# EasyEDA Pro project ProPrj_FLAVRTOWN BADGE_2026-02-28.epro, board PCB1
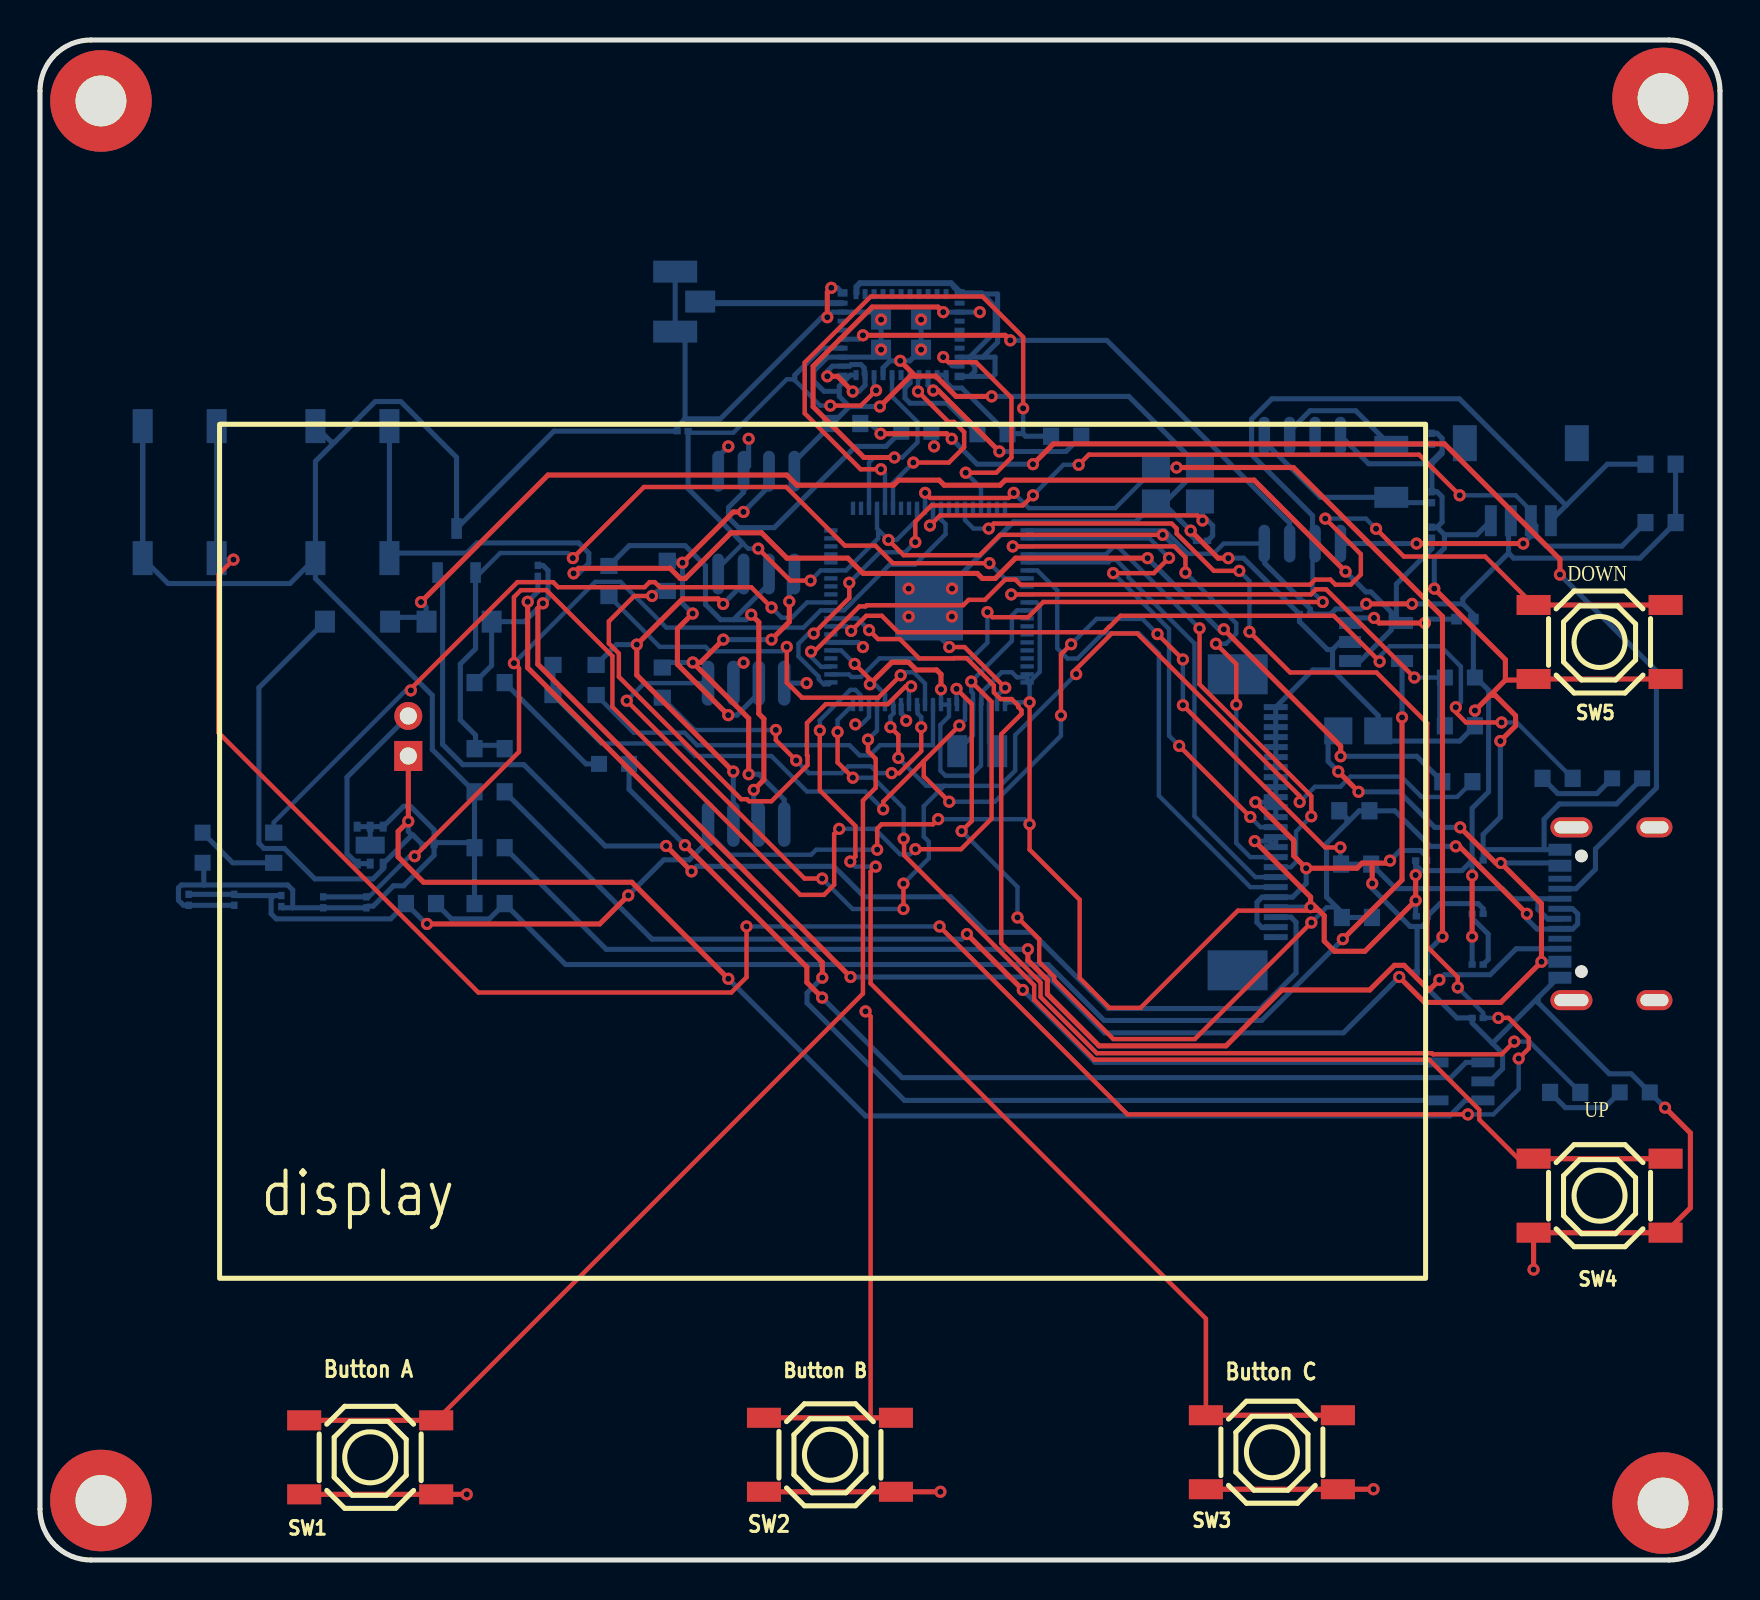
[diagram p1: board, top side]
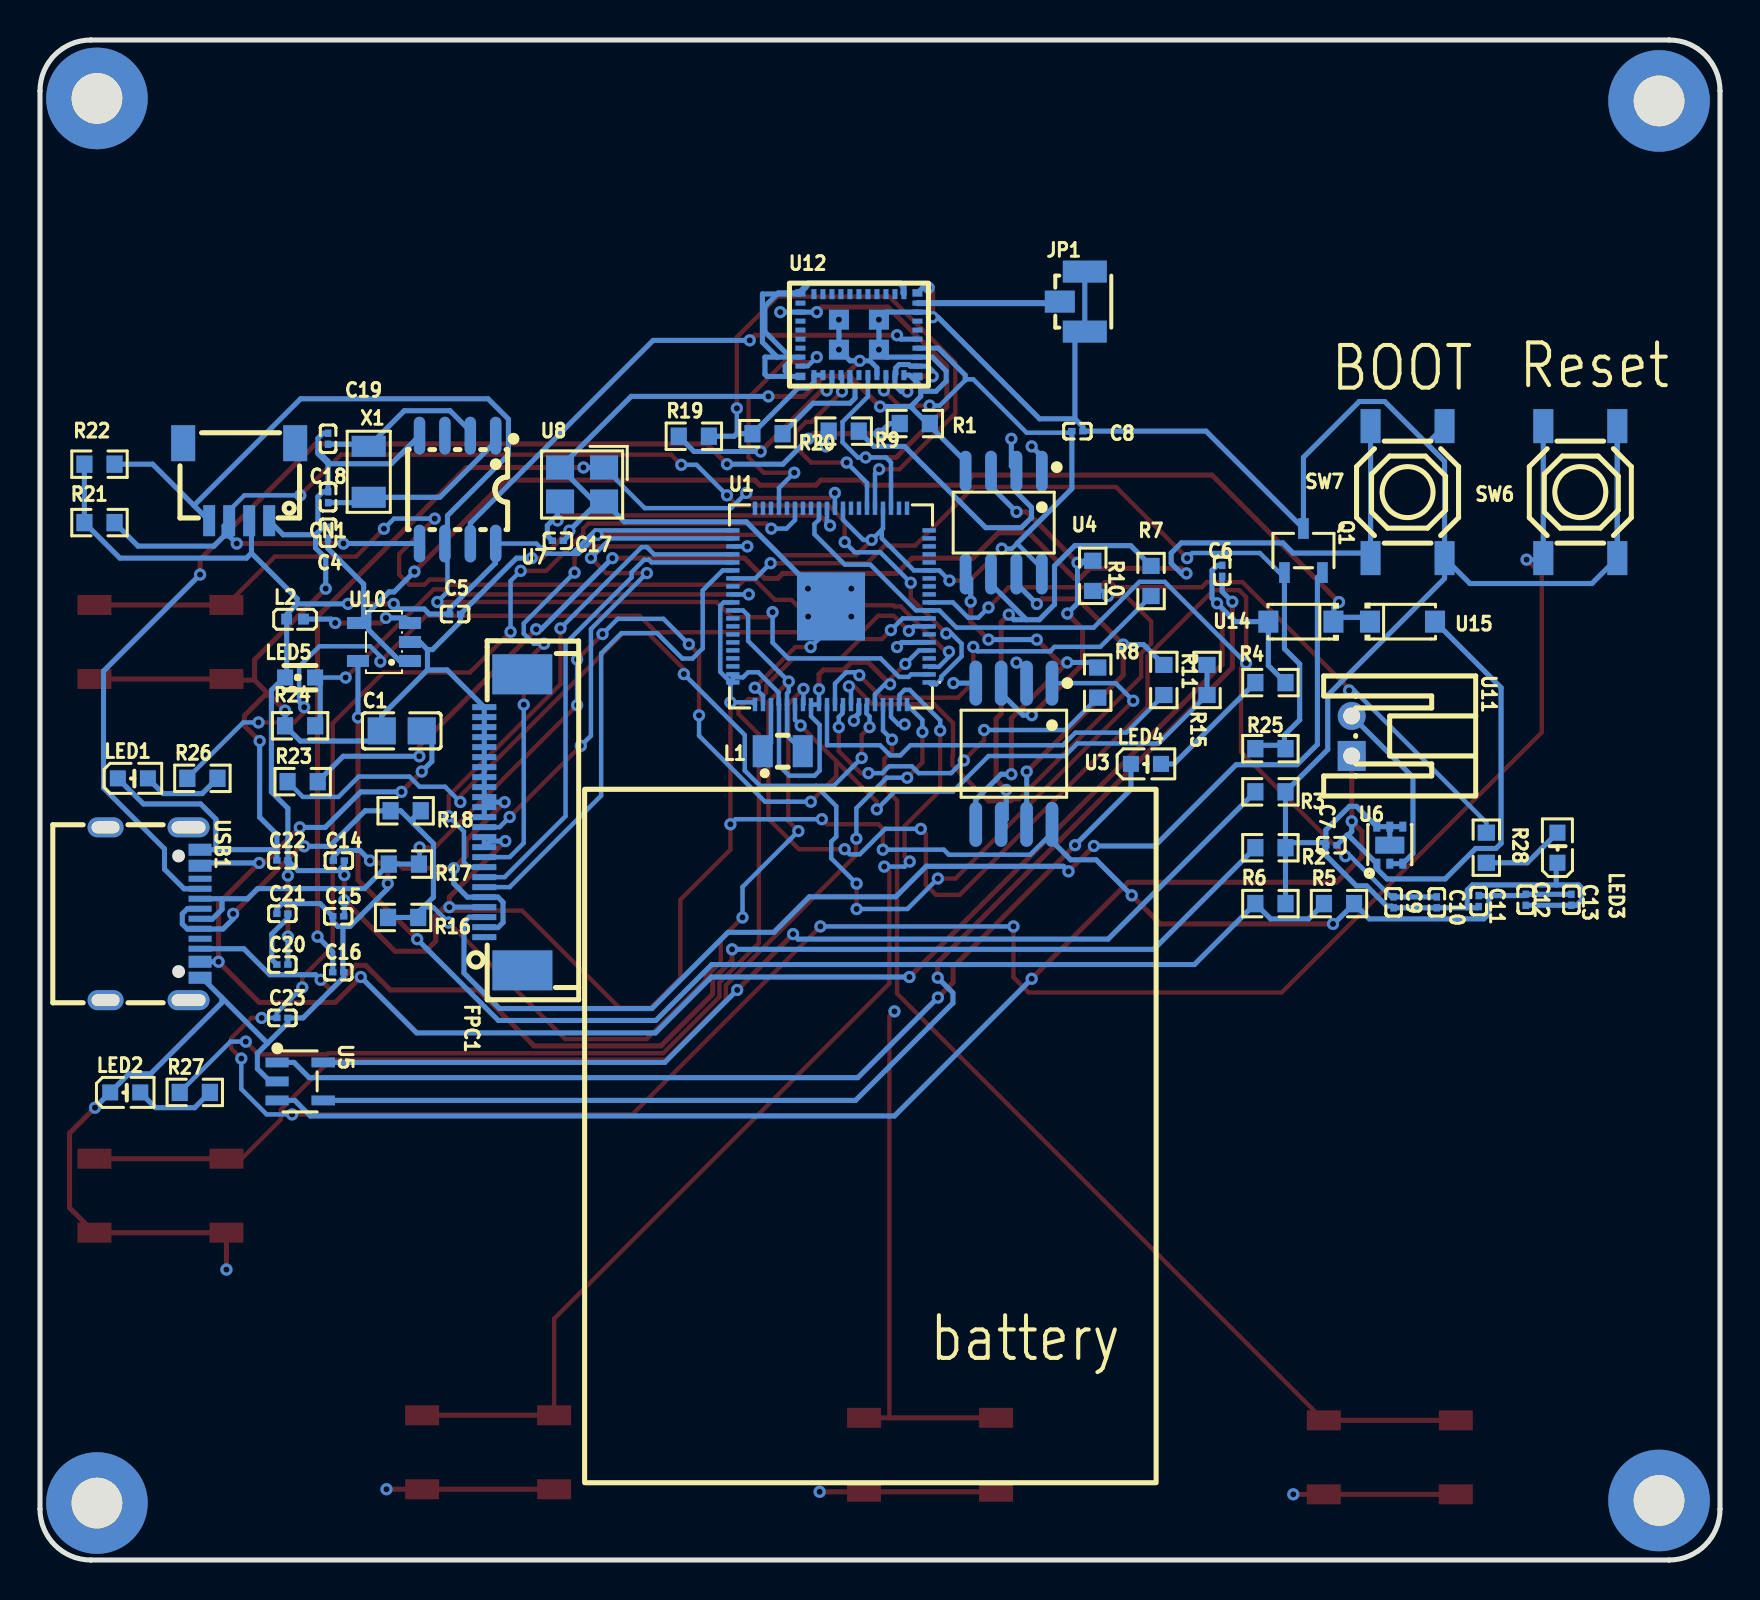
[diagram p2: board, bottom side, seen from below]

Outline 84 x 76 mm; copper layers: Top Layer, only ground, Power routing, Bottom Layer. Coordinates in mm from the lower left corner of the outline.
Outline path: 0,73.46 0,2.54 arc(0.74,0.74) 2.54,0 81.46,0 arc(83.26,0.74) 84,2.54 84,73.46 arc(83.26,75.26) 81.46,76 2.54,76 arc(0.74,75.26) 0,73.46
Stack: Top Layer 0.035mm Outer layer thickness 1oz / Dielectric1 0.2104mm 7628 RC49% 8.6mil / only ground 0.0152mm Inner layer thickness / Dielectric2 1.065mm 1.1mm H/HOZ Copper / Power routing 0.0152mm Inner layer thickness / Dielectric3 0.2104mm 7628 RC49% 8.6mil / Bottom Layer 0.035mm Outer layer thickness 1oz

## Design rules (mm)
template: JLCPCB Capability(Two Layers Board)
spacing copperThickness1oz (default): track to track 0.102, other pairs 0.152 to 0.3
spacing copperThickness2oz: track to track 0.203, other pairs 0.152 to 0.3
track width copperThickness1oz (default): min 0.127, default 0.254, max 2.54
track width copperThickness2oz: min 0.203, default 0.254, max 2.54
differential pair differentialPair (default): width min 0.127, default 0.254, max 2.54; gap min 0.152, default 0.152
via viaSize (default): diameter min 0.5, default 0.61, max 10; hole min 0.3, default 0.305, max 6.3
net VBUS_5V uses copperThickness2oz
net VSYS uses copperThickness2oz
net 3V3 uses copperThickness2oz
net VBAT uses copperThickness2oz

## Placement (name value [footprint] x y rotation side)
Button B  TS-1187A-C-E-B  [SW-SMD_4P-L5.1-W5.1-P3.70-LS6.5-TL_H2.5]  39.5 5.26 0 top
C1  100nF  [C0805]  65.91 41.46 180 bottom
C4  10μF  [C0201]  69.6 51.36 90 bottom
C5  22μF  [C0201]  63.25 47.3 0 bottom
C6  4.7μF  [C0201]  24.89 49.46 90 bottom
C7  100nF  [C0201]  19.43 35.74 0 bottom
C8  100nF  [C0201]  32.13 56.44 0 bottom
C9  4.7μF  [C0201]  16.32 32.88 270 bottom
C10  100nF  [C0201]  14.16 32.88 270 bottom
C11  100nF  [C0201]  12.06 32.95 90 bottom
C12  100nF  [C0201]  9.72 33.01 90 bottom
C13  100nF  [C0201]  7.43 33.01 270 bottom
C14  100nF  [C0201]  69.06 34.97 180 bottom
C15  100nF  [C0201]  69.09 32.19 180 bottom
C16  15pF  [C0201]  69.09 29.39 180 bottom
C17  15pF  [C0201]  58.1 50.96 0 bottom
C18  9pF  [C0201]  69.6 53.14 90 bottom
C19  9pF  [C0201]  69.6 56.06 90 bottom
C20  4.7μF  [C0201]  71.88 29.77 180 bottom
C21  100nF  [C0201]  71.88 32.31 180 bottom
C22  100nF  [C0201]  71.88 34.98 180 bottom
C23  100nF  [C0201]  71.88 27.11 180 bottom
CN1  SM04B-SRSS-TB(LF)(SN)  [CONN-SMD_4P-P1.00_SM04B-SRSS-TB-LF-SN]  74.04 53.9 0 bottom
FPC1  AFC07-S24FCA-00  [FPC-SMD_AFC07-S24FCA-00]  60.83 36.88 90 bottom
JP1  6GHz  [ANT-SMD_UFL-R-SMT-1-10]  32.38 62.92 180 bottom
L1  3.3uH  [IND-SMD_L2.0-W1.6_AOTA-B201610S3R3-101-T]  46.86 40.44 0 bottom
L2  2.2μH  [L0402]  71.25 47.04 180 bottom
LED1  19-213/T1D-KS1T1N/3T  [LED0603-R-RD]  79.36 39.08 180 bottom
LED2  19-213/T1D-KS1T1N/3T  [LED0603-R-RD]  79.74 23.38 180 bottom
LED3  19-213/T1D-KS1T1N/3T  [LED0603-R-RD]  8.13 35.61 90 bottom
LED4  19-213/T1D-KS1T1N/3T  [LED0603-R-RD]  28.7 39.81 180 bottom
LED5  PT19-21B/L41/TR8  [SENSOR-TH_PT19-21B-L41-TR8]  70.99 44.12 180 bottom
NOREF  -  [Pad_e334]  3.05 72.95 0 top
NOREF#2  -  [Pad_e339]  81.15 73.08 0 top
NOREF#3  -  [Pad_e338]  81.15 2.85 0 top
NOREF#4  -  [Pad_e337]  3.05 2.98 0 top
Q1  BSS138  [SOT-23-3_L3.0-W1.7-P0.95-LS2.9-BR]  20.83 50.47 270 bottom
R1  5.1kΩ  [R0603]  40.26 56.82 0 bottom
R2  5.1kΩ  [R0603]  22.48 35.61 0 bottom
R3  2kΩ  [R0603]  22.48 38.41 180 bottom
R4  1kΩ  [R0603]  22.48 43.87 0 bottom
R5  100kΩ  [R0603]  19.05 32.82 180 bottom
R6  22kΩ  [R0603]  22.48 32.82 0 bottom
R7  33Ω  [R0603]  28.45 48.95 270 bottom
R8  33Ω  [R0603]  31.12 43.87 270 bottom
R9  33Ω  [R0603]  43.81 56.44 0 bottom
R10  33Ω  [R0603]  31.36 49.21 270 bottom
R11  33Ω  [R0603]  27.81 44 270 bottom
R15  27Ω  [R0603]  25.65 44 90 bottom
R16  27Ω  [R0603]  65.84 32.13 0 bottom
R17  27Ω  [R0603]  65.81 34.79 0 bottom
R18  27Ω  [R0603]  65.72 37.46 0 bottom
R19  470Ω  [R0603]  51.31 56.19 180 bottom
R20  10kΩ  [R0603]  47.62 56.32 0 bottom
R21  10kΩ  [R0603]  81.03 51.87 0 bottom
R22  10kΩ  [R0603]  81.03 54.79 0 bottom
R23  1kΩ  [R0603]  70.87 38.92 180 bottom
R24  10kΩ  [R0603]  70.99 41.71 0 bottom
R25  10kΩ  [R0603]  22.48 40.57 0 bottom
R26  1kΩ  [R0603]  75.88 39.08 180 bottom
R27  1kΩ  [R0603]  76.26 23.38 180 bottom
R28  1kΩ  [R0603]  11.68 35.61 270 bottom
SW1  TS-1187A-C-E-B  [SW-SMD_4P-L5.1-W5.1-P3.70-LS6.5-TL_H2.5]  16.51 5.13 0 top
SW3  TS-1187A-C-E-B  [SW-SMD_4P-L5.1-W5.1-P3.70-LS6.5-TL_H2.5]  61.59 5.39 0 top
SW4  TS-1187A-C-E-B  [SW-SMD_4P-L5.1-W5.1-P3.70-LS6.5-TL_H2.5]  77.98 18.22 0 top
SW5  TS-1187A-C-E-B  [SW-SMD_4P-L5.1-W5.1-P3.70-LS6.5-TL_H2.5]  77.98 45.9 0 top
SW6  TS-1187A-C-E-B  [SW-SMD_4P-L5.1-W5.1-P3.70-LS6.5-TL_H2.5]  6.98 53.39 90 bottom
SW7  TS-1187A-C-E-B  [SW-SMD_4P-L5.1-W5.1-P3.70-LS6.5-TL_H2.5]  15.62 53.39 90 bottom
U1  RP2350B  [QFN-80_L10.0-W10.0-P0.40-TL-EP3.4]  44.45 47.68 0 bottom
U3  W25Q128JVSIQ  [SOIC-8_L5.3-W5.3-P1.27-LS8.0-BL]  35.31 40.31 0 bottom
U4  APS6404L-3SQR-SN  [SOIC-8_L4.9-W3.9-P1.27-LS6.0-BL]  35.81 51.87 0 bottom
U5  MCP73831T-2ACI/OT  [SOT-23-5_L3.0-W1.7-P0.95-LS2.8-BL]  70.99 23.93 270 bottom
U6  XB6096I2SV  [WDFN-6_L2.0-W2.0-P0.65-BL-EP]  16.51 35.74 180 bottom
U7  PCF85063AT/AAZ  [SO-8_L4.9-W3.9-P1.27-LS5.9-BL]  63.12 53.52 0 bottom
U8  ABM8-272-T3  [CRYSTAL-SMD_4P-L3.2-W2.5-BL]  56.9 53.78 0 bottom
U10  TLV62569DBVR  [SOT-23-5_L3.0-W1.7-P0.95-LS2.8-BR]  66.8 45.9 180 bottom
U11  S2B-PH-K-S(LF)(SN)  [CONN-TH_S2B-PH-K-S-LF-SN]  18.42 41.2 270 bottom
U12  LBEE5KL1YN-814  [LGA-46_L7.0-W5.2_LBEE5KL1DX-883]  43.05 61.27 0 bottom
U14  B5819W  [SOD-123_L2.7-W1.8-LS3.7-RD]  20.95 46.92 0 bottom
U15  B5819W  [SOD-123_L2.7-W1.8-LS3.7-RD]  15.88 46.92 180 bottom
USB1  TYPE-C16PIN  [USB-C-SMD_TYPE-C16PIN]  78.36 32.31 270 bottom
X1  32.768kHz  [CRYSTAL-SMD_L3.2-W1.5-1]  67.56 54.41 270 bottom

## Footprints (pads in the part's own frame, mm; a bottom-side part is the same pattern mirrored in y, then rotated)
ANT-SMD_UFL-R-SMT-1-10
  rect 2.2x1.1 smd: 1(0.625,1.5) 3(0.625,-1.5)
  rect 1.5x1.1 smd: 2(-0.625,0.001)
C0201
  rect 0.368x0.324 smd: 1(-0.275,0) 2(0.275,0)
C0805
  rect 1.41x1.35 smd: 1(-1,0) 2(1,0)
CONN-SMD_4P-P1.00_SM04B-SRSS-TB-LF-SN
  rect 0.6x1.55 smd: 1(-1.5,1.938) 2(-0.5,1.938) 3(0.5,1.938) 4(1.5,1.938)
  rect 1.2x1.8 smd: 5(2.8,-1.938) 6(-2.8,-1.938)
CONN-TH_S2B-PH-K-S-LF-SN
  rect 1.5x1.4 hole 0.85: 1(1,0)
  round 1.4 hole 0.85: 2(-1,0)
CRYSTAL-SMD_4P-L3.2-W2.5-BL
  rect 1.4x1.2 smd: 1(-1.1,-0.85) 2(1.1,-0.85) 3(1.1,0.85) 4(-1.1,0.85)
CRYSTAL-SMD_L3.2-W1.5-1
  rect 1.05x1.7 smd: 1(-1.275,0) 2(1.275,0)
FPC-SMD_AFC07-S24FCA-00
  rect 0.3x1.2 smd: 1(-5.74,0.953) 2(-5.239,0.953) 3(-4.739,0.953) 4(-4.242,0.953) 5(-3.741,0.953) 6(-3.24,0.953) 7(-2.74,0.953) 8(-2.24,0.953) 9(-1.74,0.953) 10(-1.24,0.953) 11(-0.74,0.953) 12(-0.241,0.953) 13(0.26,0.953) 14(0.76,0.953) 15(1.26,0.953) 16(1.76,0.953) 17(2.26,0.953) 18(2.759,0.953) 19(3.26,0.953) 20(3.76,0.953) 21(4.26,0.953) 22(4.761,0.953) 23(5.261,0.953) 24(5.76,0.953)
  rect 2x3 smd: 25(-7.401,-0.953) 26(7.401,-0.947)
IND-SMD_L2.0-W1.6_AOTA-B201610S3R3-101-T
  rect 1x1.6 smd: 1(-1,0) 2(1,0)
L0402
  rect 0.54x0.54 smd: 1(-0.42,0) 2(0.42,0)
LED0603-R-RD
  rect 0.8x0.8 smd: 1(0.751,0) 2(-0.751,0)
LGA-46_L7.0-W5.2_LBEE5KL1DX-883
  custom 0.25x0.5 smd: 1(-2.25,-2.025) 2(-1.8,-2.025) 3(-1.35,-2.025) 4(-0.9,-2.025) 5(-0.45,-2.025) 6(0,-2.025) 7(0.45,-2.025) 8(0.9,-2.025) 9(1.35,-2.025) 10(1.8,-2.025) 11(2.25,-2.025) 22(2.25,2.025) 23(1.8,2.025) 24(1.35,2.025) 25(0.9,2.025) 26(0.45,2.025) 27(0,2.025) 28(-0.45,2.025) 29(-0.9,2.025) 30(-1.35,2.025) 31(-1.8,2.025) 32(-2.25,2.025)
  rect 0.5x0.375 smd: 12(2.925,-2.087) 21(2.925,2.087) 33(-2.925,2.087) 42(-2.925,-2.087)
  rect 0.5x0.25 smd: 13(2.925,-1.575) 14(2.925,-1.125) 15(2.925,-0.675) 16(2.925,-0.226) 17(2.925,0.225) 18(2.925,0.675) 19(2.925,1.125) 20(2.925,1.575) 34(-2.925,1.575) 35(-2.925,1.125) 36(-2.925,0.675) 37(-2.925,0.225) 38(-2.925,-0.226) 39(-2.925,-0.675) 40(-2.925,-1.125) 41(-2.925,-1.575)
  rect 1x1 smd: 43(-1,-0.75) 44(1,-0.75) 45(-1,0.75) 46(1,0.75)
Pad_e334
  round 5.08 hole 2.54: 1(0,0)
Pad_e337
  round 5.08 hole 2.54: 1(0,0)
Pad_e338
  round 5.08 hole 2.54: 2(0,0)
Pad_e339
  round 5.08 hole 2.54: 3(0,0)
QFN-80_L10.0-W10.0-P0.40-TL-EP3.4
  rect 0.665x0.22 smd: 1(-4.907,3.8) 2(-4.907,3.4) 3(-4.907,3) 4(-4.907,2.6) 5(-4.907,2.2) 6(-4.907,1.8) 7(-4.907,1.4) 8(-4.907,1) 9(-4.907,0.6) 10(-4.907,0.2) 11(-4.907,-0.2) 12(-4.907,-0.6) 13(-4.907,-1) 14(-4.907,-1.4) 15(-4.907,-1.8) 16(-4.907,-2.2) 17(-4.907,-2.6) 18(-4.907,-3) 19(-4.907,-3.4) 20(-4.907,-3.8) 41(4.907,-3.8) 42(4.907,-3.4) 43(4.907,-3) 44(4.907,-2.6) 45(4.907,-2.2) 46(4.907,-1.8) 47(4.907,-1.4) 48(4.907,-1) 49(4.907,-0.6) 50(4.907,-0.2) 51(4.907,0.2) 52(4.907,0.6) 53(4.907,1) 54(4.907,1.4) 55(4.907,1.8) 56(4.907,2.2) 57(4.907,2.6) 58(4.907,3) 59(4.907,3.4) 60(4.907,3.8)
  rect 0.22x0.665 smd: 21(-3.8,-4.907) 22(-3.4,-4.907) 23(-3,-4.907) 24(-2.6,-4.907) 25(-2.2,-4.907) 26(-1.8,-4.907) 27(-1.4,-4.907) 28(-1,-4.907) 29(-0.6,-4.907) 30(-0.2,-4.907) 31(0.2,-4.907) 32(0.6,-4.907) 33(1,-4.907) 34(1.4,-4.907) 35(1.8,-4.907) 36(2.2,-4.907) 37(2.6,-4.907) 38(3,-4.907) 39(3.4,-4.907) 40(3.8,-4.907) 61(3.8,4.907) 62(3.4,4.907) 63(3,4.907) 64(2.6,4.907) 65(2.2,4.907) 66(1.8,4.907) 67(1.4,4.907) 68(1,4.907) 69(0.6,4.907) 70(0.2,4.907) 71(-0.2,4.907) 72(-0.6,4.907) 73(-1,4.907) 74(-1.4,4.907) 75(-1.8,4.907) 76(-2.2,4.907) 77(-2.6,4.907) 78(-3,4.907) 79(-3.4,4.907) 80(-3.8,4.907)
  rect 3.4x3.4 smd: 81(0,0)
R0603
  rect 0.806x0.864 smd: 1(-0.753,0) 2(0.753,0)
SENSOR-TH_PT19-21B-L41-TR8
  rect 0.8x0.8 smd: 1(0.75,0) 2(-0.75,0)
SO-8_L4.9-W3.9-P1.27-LS5.9-BL
  oval 0.574x1.888 smd: 1(-1.905,-2.699) 2(-0.635,-2.699) 3(0.635,-2.699) 4(1.905,-2.699) 5(1.905,2.699) 6(0.635,2.699) 7(-0.635,2.699) 8(-1.905,2.699)
SOD-123_L2.7-W1.8-LS3.7-RD
  rect 1x1.1 smd: 1(-1.627,0) 2(1.627,0)
SOIC-8_L4.9-W3.9-P1.27-LS6.0-BL
  oval 0.588x2.045 smd: 1(-1.905,-2.57) 2(-0.635,-2.57) 3(0.635,-2.57) 4(1.905,-2.57) 5(1.905,2.57) 6(0.635,2.57) 7(-0.635,2.57) 8(-1.905,2.57)
SOIC-8_L5.3-W5.3-P1.27-LS8.0-BL
  oval 0.63x2.25 smd: 1(-1.905,-3.53) 2(-0.635,-3.53) 3(0.635,-3.53) 4(1.905,-3.53) 5(1.905,3.53) 6(0.635,3.53) 7(-0.635,3.53) 8(-1.905,3.53)
SOT-23-3_L3.0-W1.7-P0.95-LS2.9-BR
  rect 1.038x0.532 smd: 1(1.101,-0.95) 2(1.101,0.95) 3(-1.101,0)
SOT-23-5_L3.0-W1.7-P0.95-LS2.8-BL
  rect 0.49x1.157 smd: 1(-0.95,-1.153) 2(0,-1.153) 3(0.95,-1.153)
  rect 0.49x1.175 smd: 4(0.95,1.153) 5(-0.95,1.153)
SOT-23-5_L3.0-W1.7-P0.95-LS2.8-BR
  rect 1.1x0.6 smd: 1(1.3,-0.95) 2(1.3,0) 3(1.3,0.95) 4(-1.3,0.95) 5(-1.3,-0.95)
SW-SMD_4P-L5.1-W5.1-P3.70-LS6.5-TL_H2.5
  rect 1.7x1 smd: 1(-3.3,1.85) 2(3.3,1.85) 3(-3.3,-1.85) 4(3.3,-1.85)
USB-C-SMD_TYPE-C16PIN
  oval 1x2.1 hole 0.6x1.7: 1(-4.32,1.788) 2(4.32,1.788)
  oval 1x1.8 hole 0.6x1.4: 3(-4.32,-2.362) 4(4.32,-2.362)
  rect 0.6x1.15 smd: A1B12(-3.2,2.362) A4B9(-2.4,2.362) B1A12(3.2,2.362) B4A9(2.4,2.362)
  rect 0.3x1.15 smd: A5(-1.25,2.362) A6(-0.25,2.362) A7(0.25,2.362) A8(1.25,2.362) B5(1.75,2.362) B6(0.75,2.362) B7(-0.75,2.362) B8(-1.75,2.362)
WDFN-6_L2.0-W2.0-P0.65-BL-EP
  rect 0.35x0.5 smd: 1(-0.65,-0.925) 2(0,-0.925) 3(0.65,-0.925) 4(0.65,0.925) 5(0,0.925) 6(-0.65,0.925)
  rect 1.45x0.85 smd: 7(0,0)

## Nets
As in the schematic, except:
GND: Button B.3 Button B.4 C1.1 C4.2 C5.1 C7.2 C8.1 C9.2 C10.2 C11.1 C12.1 C13.2 C14.1 C15.1 C16.2 C17.1 C18.2 C19.2 C21.1 C22.1 C23.2 CN1.1 FPC1.2 FPC1.5 FPC1.13 FPC1.14 FPC1.15 FPC1.16 FPC1.17 FPC1.18 FPC1.19 FPC1.20 FPC1.21 FPC1.22 FPC1.23 FPC1.24 JP1.1 JP1.3 LED1.2 LED2.2 LED3.2 Q1.3 R1.1 R2.1 R3.2 R6.1 R24.2 SW1.3 SW1.4 SW3.3 SW3.4 SW4.3 SW4.4 SW5.3 SW5.4 SW6.3 SW6.4 SW7.3 SW7.4 U1.62 U1.81 U3.4 U4.4 U5.2 U6.4 U6.5 U6.6 U6.7 U7.4 U8.2 U8.4 U10.2 U12.29 U12.32 U12.33 U12.35 U12.40 U12.42 U12.43 U12.44 U12.45 U12.46 USB1.A1B12 USB1.B1A12
GPIO_1: Button B.1 Button B.2 U1.78

Pads without a net: CN1 5 6; FPC1 1 25 26; NOREF 1; NOREF#2 3; NOREF#3 2; NOREF#4 1; U1 4 7 12 13 14 16 17 18 19 20 21 22 27 28 33 34 36 38 39 40 48 52 53 54 55 56 57 58; U7 3; U12 2 3 4 5 6 7 8 9 10 11 13 15 16 17 18 27 38 39; USB1 1 2 3 4 A8 B8

## Via types
v1: diameter 0.61, hole 0.305, Top Layer to Bottom Layer, 218 vias

## Routing (per net, layer and track width the routed paths; a pad name or vN(x,y) marks a point on that pad's centre or on a via; arc(x,y) is an arc through that point)
1V1: length 100.3
  Top Layer w0.22: v1(46.56,43.92) 47.58,42.91 47.58,37.07 46.06,35.54 v1(43.77,35.54) ; v1(39.96,36.56) 39.71,36.3 39.71,33.76 39.2,33.26 38.02,33.26 28.62,42.65 28.62,45.19 25.32,48.5 24.05,48.5 23.7,48.14 v1(23.7,44.84) 23.95,44.59 23.95,40.41 v1(18.73,35.19)
  Bottom Layer w0.22: v1(39.96,36.56) 41.74,36.56 43.01,35.29 43.52,35.29 v1(43.77,35.54) ; U1.51 48.85,47.48 48.6,47.23 48.6,45.96 v1(46.56,43.92) 46.56,43.42 46.65,43.33 U1.65 46.65,41.23 L1.1 ; U1.32 45.05,52.02 45.28,51.8 45.28,51.29 43.75,49.77 42.48,49.77 40.2,47.48 U1.10 39.03,47.48 38.18,46.62 31.32,46.62 29.03,48.91 27.76,48.91 v1(23.7,44.84) ; C9.1 16.45,33.16 18.48,35.19 v1(18.73,35.19)
  Bottom Layer w0.254: C9.1 C10.1
3V3: length 244.9
  Top Layer w0.22: v1(44.91,37.04) 44.65,36.79 42.08,36.79 41.86,36.57 v1(41.86,35.52) ; v1(56.13,51.26) 48.01,51.26 46.99,50.24 43.18,50.24 v1(42.42,51) ; v1(41.49,43.79) 41.49,44.04 v1(40.73,44.8) ; v1(38.53,48.97) 37.51,48.97 v1(35.91,50.57) ; 63.96,32.47 59.89,32.47 55.03,27.61 53.47,27.61 52.57,28.5 52.57,28.51 51.98,29.1 51.98,33.01 49.48,35.52 v1(49.48,36.79) v1(49.48,42.88) ; v1(41.8,58.48) 41.04,57.72 v1(39.52,57.72)
  Top Layer w0.254: v1(60.74,35.94) 63.53,33.15 v1(63.53,32.64) 63.78,32.64 64.21,32.22 64.21,30.95 64.72,30.44 66.24,30.44 v1(68.78,32.98) v1(68.78,34.25) ; v1(71.61,34.22) v1(71.61,31.17) ; v1(41.49,43.79) 42.59,44.89 43.43,44.89 43.81,44.5 44.83,44.5 45.05,44.29 v1(45.05,43.53) ; v1(29.41,33.23) 27.99,31.8 v1(19.35,31.8) ; v1(66.31,47.81) v1(68.6,47.81)
  Bottom Layer w0.22: v1(56.13,51.26) 57.08,50.31 57.4,50.31 ; 49.48,43.76 49.36,43.88 49.36,44.13 ; 49.48,43.76 49.48,43.9 49.99,44.41 49.99,47.71 49.82,47.88 49.36,47.88 ; 49.48,43.76 v1(49.48,42.88) 48.36,42.88 U1.61 ; U1.41 56.24,51.48 57.4,50.31 ; v1(45.05,43.53) U1.69 U1.68 45.45,42.19 45.02,41.76 45.02,39.47 45.27,39.22 46.54,39.22 47.05,39.72 U1.64 47.07,42.79 47.07,43.37 48.09,44.39 48.6,44.39 48.85,44.13 49.36,44.13 ; U1.5 40.06,45.48 v1(40.73,44.8) ; v1(44.91,37.04) 49.23,37.04 v1(49.48,36.79) ; v1(41.49,43.79) 41.75,43.79 42.26,43.28 U1.76 ; 49.36,44.13 U1.59 ; v1(35.91,50.57) 35.4,50.57 35.15,50.82 33.91,49.58 U4.8 ; 57.4,50.31 58.67,50.31 59.18,50.82 U7.8 ; 41.91,51.51 v1(42.42,51) 42.83,51 43.85,52.02 U1.29 ; 41.91,51.51 41.85,51.57 U1.24 ; 41.91,51.51 41.91,51.08 40.3,49.48 U1.15 39.03,49.48 v1(38.53,48.97) ; 32.41,56.36 34.67,56.36 37.34,59.03 37.7,59.03 37.74,58.99 39.01,57.72 v1(39.52,57.72) ; v1(41.86,35.52) 38.81,35.52 38.56,35.26 34.49,35.26 33.48,36.28 33.48,36.71 U3.8 ; U12.30 41.7,58.58 v1(41.8,58.48)
  Bottom Layer w0.25: 40.13,60.59 39.09,60.59 37.74,59.24 37.74,58.99
  Bottom Layer w0.254: 11.7,33.22 11.56,33.07 11.56,32.31 11.81,32.06 17.53,32.06 R5.2 19.31,31.8 v1(19.35,31.8) ; 11.7,33.22 C11.2 ; 11.7,33.22 9.78,33.22 C12.2 C13.1 ; 73.43,50.35 73.43,51.85 CN1.2 ; 73.43,50.35 71.14,48.06 71.14,47.81 ; 73.43,50.35 73.68,50.09 80,50.09 R21.2 R22.2 ; 68.78,34.76 69.07,34.47 71.1,34.47 C22.2 ; 68.78,34.76 v1(68.78,34.25) ; 68.78,34.76 C14.2 ; v1(66.31,47.81) 66.06,47.55 64.79,47.55 64.54,47.3 C5.2 63.52,47.55 61.23,49.84 61.23,50.8 U7.8 ; 71.14,47.81 71.67,47.28 L2.1 71.67,44.25 ; 71.14,47.81 v1(68.6,47.81) ; v1(63.53,32.64) FPC1.4 ; LED5.2 71.67,44.2 71.67,44.25 ; 71.67,44.25 72.43,43.49 72.43,38.41 71.61,37.59 C22.2 ; 35.15,50.82 32.41,53.57 C8.2 ; 33.48,36.28 33.48,36.03 32.46,35.01 31.19,35.01 v1(29.41,33.23) ; v1(60.74,35.94) 61.49,35.94 FPC1.10 FPC1.11 ; v1(68.78,32.98) 68.78,32.22 C15.2 ; C22.2 v1(71.61,34.22) ; v1(71.61,31.17) C20.2
GND: length 372.1
  Top Layer w0.22: v1(45.47,45.65) 46.23,45.65 v1(48.26,43.62)
  Top Layer w0.25: v1(39.37,62.14) 39.37,63.41 v1(39.57,63.61) ; 43.77,59.2 v1(43.01,59.96)
  Top Layer w0.254: v1(69.71,48.57) 73.27,45.01 73.27,44 ; SW1.3 SW1.4 v1(21.34,3.28) ; v1(74.68,14.52) SW4.3 81.28,16.37 82.52,17.61 82.52,21.35 v1(81.25,22.62) ; 66.61,34.84 66.1,34.84 65.85,34.59 v1(63.31,34.59) 62.68,35.21 62.68,35.98 v1(60.77,37.89) ; 66.61,34.84 v1(66.61,33.83) ; 66.61,34.84 67.37,34.84 v1(67.5,34.97) ; SW3.3 SW3.4 v1(66.68,3.54) ; v1(41.99,57.67) 43.52,59.2 44.79,59.2 45.8,58.18 v1(47.58,58.18) ; 72.51,43.23 72.76,43.23 73.78,42.22 73.78,41.71 v1(73.02,40.95) ; 72.51,43.23 73.27,44 ; 72.51,43.23 v1(71.75,42.47) ; 73.27,44 74.62,44 SW5.3 81.28,44.05 ; v1(57.53,51.47) 58.91,50.09 v1(59.42,50.09) ; v1(45.02,3.41) 36.2,3.41
  Bottom Layer w0.22: U1.62 47.85,43.21 v1(48.26,43.62) ; U1.81 44.45,46.66 v1(45.47,45.65)
  Bottom Layer w0.25: 40.22,58.94 40.52,59.24 U12.32 ; 40.22,58.94 40.13,59.18 ; 40.22,58.94 39.96,58.69 39.96,58.44 ; 39.96,58.44 39.2,58.44 38.69,58.94 38.69,59.45 39.38,60.14 40.13,60.14 ; 39.96,58.44 39.96,58.18 40.47,57.67 ; v1(39.57,63.61) 39.87,63.61 40.13,63.36 ; v1(39.37,62.14) 39.62,62.39 40.13,62.39 ; 42.15,59.61 42.5,59.96 v1(43.01,59.96)
  Bottom Layer w0.254: SW6.3 SW6.4 SW6.3 ; SW6.3 6.41,48.82 12.5,48.82 SW7.3 ; 8.19,33.75 12.38,33.75 12.64,33.5 12.64,32.61 ; 8.19,33.75 8.19,34.8 LED3.2 ; 8.19,33.75 7.07,33.75 6.92,33.61 6.92,32.99 7.18,32.74 C13.2 C12.1 ; 74.91,28.12 75.9,29.11 USB1.B1A12 ; 74.91,28.12 74.91,27.87 78.47,24.31 79.56,24.31 LED2.2 v1(81.25,22.62) ; 74.91,28.12 72.62,25.84 ; 32.25,57.06 32.25,60.93 JP1.3 JP1.1 ; 32.25,57.06 31.86,56.66 C8.1 25.7,56.44 Q1.3 20.83,55.13 18.03,57.92 16.76,57.92 14.73,55.89 ; 32.25,57.06 34.02,57.06 39.1,62.14 v1(39.37,62.14) ; v1(67.5,34.97) 68.01,35.48 69.03,35.48 69.33,35.17 C14.1 ; 56.26,52.74 56.07,52.93 U8.4 54.78,51.91 48.68,51.91 U1.81 ; 56.26,52.74 56.26,52.89 58,54.63 54.44,58.18 v1(47.58,58.18) ; 56.26,52.74 v1(57.53,51.47) 57.53,51.26 C17.1 ; U4.4 37.72,54.92 39.45,56.66 ; SW7.3 13.77,54.93 14.73,55.89 ; SW7.3 13.77,49.08 19.61,43.24 19.61,40.52 R3.2 21.73,35.87 ; 72.16,35.52 72.16,36.28 73.02,37.14 v1(73.02,40.95) ; 72.16,35.52 75.2,35.52 ; 72.16,35.52 C22.1 ; 75.2,35.52 75.2,37.04 75.97,37.8 78.83,37.8 LED1.2 ; 75.2,35.52 75.99,35.52 ; v1(38.33,43.84) U3.4 ; 61.79,37.89 v1(60.77,37.89) ; 61.79,37.89 FPC1.15 FPC1.16 FPC1.17 FPC1.18 FPC1.19 FPC1.20 FPC1.21 FPC1.22 FPC1.23 FPC1.24 63.65,44.5 64.63,44.5 ; 61.79,37.89 FPC1.14 FPC1.13 ; 70.1,55.45 70.1,55.32 69.6,54.81 ; 70.1,55.45 70.1,56.08 69.85,56.34 C19.2 ; 70.1,55.45 69.6,54.94 69.6,54.81 ; 69.6,54.81 C18.2 69.85,53.41 70.1,53.16 70.1,51.89 69.85,51.64 ; 69.6,54.81 66.43,54.81 U7.4 ; 12.64,32.61 12.13,32.61 C11.1 ; 12.64,32.61 C10.2 C9.2 16.4,32.69 16.66,32.69 17.67,33.71 18.18,33.71 19.71,35.23 C7.2 ; 14.73,55.89 14.57,55.89 SW7.4 ; 64.63,44.5 64.63,45.52 ; 64.63,44.5 66.91,42.22 C1.1 67.42,40.95 70.98,40.95 R24.2 v1(71.75,42.47) ; 64.63,45.52 64.37,45.52 62.97,46.92 C5.1 60.18,50.09 v1(59.42,50.09) ; 64.63,45.52 65.01,45.9 U10.2 ; 39.45,56.66 40.47,57.67 v1(41.99,57.67) ; 39.45,56.66 39.45,56.77 R1.1 ; 68.85,31.68 68.85,29.43 C16.2 68.81,29.14 70.85,27.11 C23.2 71.61,26.85 72.62,25.84 ; 68.85,31.68 69.11,31.68 69.36,31.93 C15.1 70,32.82 71.9,32.82 72.16,32.57 C21.1 ; 68.85,31.68 68.51,31.68 66.61,33.57 v1(66.61,33.83) ; v1(43.01,59.96) 43.49,59.96 v1(44.05,60.52) v1(44.05,62.02) ; 42.15,59.61 U12.29 ; 21.73,35.87 19.83,35.87 C7.2 ; 21.73,35.87 R2.1 R6.1 ; U6.5 U6.7 ; U6.5 U6.4 ; U6.5 U6.6 18.18,37.68 18.53,37.68 19.71,36.5 C7.2 ; U5.2 72.5,23.93 73.13,24.57 73.13,25.33 72.62,25.84 ; 69.85,51.64 C4.2 ; 69.85,51.64 70.22,51.26 ; CN1.1 71.84,51.26 70.22,51.26 ; 70.22,51.26 70.22,50.6 69.71,50.09 v1(69.71,48.57) ; FPC1.2 61.76,31.62 61.1,31.62 60.85,31.87 60.85,32.89 61.1,33.14 FPC1.5 62.63,33.14 63.31,33.83 v1(63.31,34.59) ; 40.13,62.39 41.68,62.39 v1(42.05,62.02) v1(42.05,60.52) 41.68,60.14 40.13,60.14
  vias: v1(43.43,48.57) v1(43.43,47.17) v1(45.59,47.17) v1(45.6,48.57)
VBAT: length 88.6
  Top Layer w0.254: v1(34.42,29.06) 29.59,33.89 19.18,33.89 17.91,35.16 17.91,36.43 v1(18.42,36.94) U11.1
  Bottom Layer w0.254: U5.3 71.26,22.98 70.49,22.2 41.28,22.2 v1(34.42,29.06) ; 18.59,36.25 18.65,36.25 C7.1 ; 18.59,36.25 U6.1 17.16,34.56 16.65,34.05 13.74,34.05 12.22,35.58 11.2,35.58 10.95,35.83 10.95,43.62 U15.2 ; 18.59,36.25 18.42,36.43 v1(18.42,36.94)
VBUS_5V: length 94.4
  Top Layer w0.254: v1(71.01,36.63) 72.79,34.85 v1(73.04,34.85) 75.07,32.82 v1(75.07,29.91) 73.04,27.88 69.23,27.88 v1(67.96,29.15) ; v1(25.15,47.84) 24.89,47.58 24.89,44.79 v1(40.53,29.15) ; v1(64.91,39.42) v1(65.93,38.41)
  Bottom Layer w0.254: R4.1 22.58,44.73 U14.2 24.23,46.92 v1(25.15,47.84) 25.4,48.09 25.4,49.48 25.15,49.73 C6.2 ; v1(67.96,29.15) 65.17,26.36 53.23,26.36 50.44,29.15 v1(40.53,29.15) ; v1(75.07,29.91) USB1.B4A9 ; v1(73.04,34.85) 75.86,34.85 USB1.A4B9 ; v1(65.93,38.41) 67.96,38.41 69.74,36.63 v1(71.01,36.63) ; C1.2 64.41,40.95 64.41,39.93 v1(64.91,39.42)
BAT_MINUS: length 9.5
  Bottom Layer w0.254: U6.2 U6.3 15.35,35.32 15.35,39.14 U11.2
GPIO40_ADC0: length 27
  Top Layer w0.22: v1(68.72,44.12) 64.31,48.53 63.8,48.53 63.55,48.28 v1(48.56,48.28)
  Bottom Layer w0.22: LED5.1 v1(68.72,44.12) ; v1(48.56,48.28) U1.49
  Bottom Layer w0.254: R24.1 69.99,41.96 69.99,43.87 LED5.1
GPIO_0: length 51.8
  Top Layer w0.22: SW1.2 41.15,28.32 41.15,37.97 41.78,38.61 41.78,40.06 41.4,40.44 v1(41.4,41.02)
  Top Layer w0.254: SW1.1 SW1.2
  Bottom Layer w0.22: v1(41.4,41.02) 41.85,41.47 U1.77
GPIO_1: length 50.8
  Top Layer w0.22: v1(41.28,27.43) 41.53,27.18 41.53,7.11
  Top Layer w0.254: Button B.1 Button B.2
  only ground w0.254: v1(41.28,27.43) 41.28,26.98 40,25.71 38.35,25.71 36.7,27.36 36.7,34.09 39.38,36.76 39.38,39.3 40.77,40.7 v1(40.77,41.78)
  Bottom Layer w0.22: U1.78 41.45,42.15 41.08,41.78 v1(40.77,41.78)
GPIO_2: length 53.6
  Top Layer w0.22: v1(40.52,34.92) 40.77,35.18 40.77,36.7 38.99,38.48 v1(38.99,41.47) ; v1(41.78,34.67) 41.53,34.42 41.53,28.83 58.29,12.06 SW3.1
  Top Layer w0.254: SW3.1 SW3.2
  Bottom Layer w0.22: v1(38.99,41.47) 38.99,41.98 40.52,43.51 40.77,43.51 41.02,43.25 41.02,42.8 U1.79 ; v1(40.52,34.92) 40.77,34.67 v1(41.78,34.67)
GPIO_3: length 54.9
  Top Layer w0.22: v1(39.88,41.4) 39.88,39.88 v1(40.64,39.12) ; v1(43.18,36.07) 43.25,36 43.25,35.94 43.2,35.89 43.2,35.24 49.71,28.74 49.71,28.02 52.71,25.02 69.46,25.02 71.96,22.51 71.96,22.02 73.92,20.07 SW4.1
  Top Layer w0.254: SW4.1 81.28,20.07
  Bottom Layer w0.22: U1.80 39.88,42 v1(39.88,41.4) ; v1(40.64,39.12) 41.66,39.12 43.18,37.59 v1(43.18,36.07)
GPIO_6: length 53.3
  Top Layer w0.22: SW5.1 72.26,50.17 68.19,50.17 v1(66.8,51.56) ; v1(38.55,45.42) 38.71,45.42 40.97,47.68 41.28,47.68 41.33,47.74 46.16,47.74 46.43,48.01 47.25,48.01 48.26,49.02 48.77,49.02 49.02,48.77 63.5,48.77 63.76,49.02 64.52,49.02 64.77,48.77 65.53,48.77 66.04,49.28 66.04,50.29 v1(64.26,52.07)
  Top Layer w0.254: SW5.1 81.28,47.75
  Bottom Layer w0.22: v1(66.8,51.56) 66.3,52.07 v1(64.26,52.07) ; v1(38.55,45.42) 38.55,45.16 39.06,44.66 39.52,44.66 U1.3
GPIO_8: length 16.7
  only ground w0.254: v1(41.15,45.65) 40.92,45.87 40.32,45.87 38.28,47.9 38.28,48.39 36.5,50.18 36.5,50.81 35.49,51.82 34.93,51.82 34.59,52.16 34.59,52.21 34.42,52.38 v1(34.42,55.68)
  Bottom Layer w0.254: v1(34.42,55.68) 33.91,55.17 U4.1 ; v1(41.15,45.65) 40.92,45.88 40.81,45.88 40.8,45.87 40.32,45.87 40.31,45.88 39.54,45.88
GPIO_10: length 44
  Top Layer w0.22: v1(73.08,41.88) 71.3,41.88 70.79,42.39 v1(70.79,42.64) ; v1(40.56,46.46) 41.31,47.21 42.09,47.21 42.91,46.39 53.19,46.39 53.45,46.65 53.47,46.65 54.03,47.21 64.7,47.21 v1(66.98,44.93)
  Bottom Layer w0.22: U1.8 40.34,46.68 v1(40.56,46.46) ; v1(73.08,41.88) 73.84,41.88 R26.1 ; v1(70.79,42.64) 71.05,42.89 71.05,44.67 70.03,45.69 67.49,45.69 66.98,45.18 v1(66.98,44.93)
GPIO_11: length 56.8
  Top Layer w0.22: v1(41.45,46.49) 41.9,46.05 42.99,46.05 43.96,45.08 45.7,45.08 45.72,45.1 46.32,45.1 47.69,43.73 47.69,43.38 48.03,43.05 48.58,43.05 48.91,42.72 48.91,42.65 49.07,42.49 49.07,42.3 48.06,41.29 48.06,30.84 50.03,28.87 50.03,28.15 52.84,25.34 69.59,25.34 69.65,25.28 73.08,25.28 v1(73.71,25.92)
  Bottom Layer w0.22: R27.1 74.47,25.92 v1(73.71,25.92) ; v1(41.45,46.49) 40.87,47.08 39.54,47.08
GPIO_12: length 34.7
  Top Layer w0.22: v1(36.58,47.63) 35.56,48.64 30.99,48.64 30.73,48.9 30.48,48.9 30.23,48.64 25.91,48.64 25.65,48.9 23.88,48.9 18.54,43.56 v1(18.54,43.48)
  Bottom Layer w0.22: v1(18.54,43.48) 18.29,43.48 11.68,36.88 R28.1 ; 39.54,47.88 38.35,47.88 37.59,47.12 37.08,47.12 v1(36.58,47.63)
I2C_SCL: length 62.4
  Top Layer w0.22: v1(47.37,47.39) 47.62,47.14 49.4,47.14 50.16,47.9 v1(64.13,47.9)
  Bottom Layer w0.22: v1(64.13,47.9) 63.63,48.41 63.63,50.95 ; v1(47.37,47.39) 47.37,45.87 46.58,45.08 41.97,45.08 41.04,44.15 40.57,44.15 40.45,44.28 U1.2
  Bottom Layer w0.254: U7.6 63.63,50.95 63.63,52.22 60.58,55.27 60.58,57.04 61.59,58.06 70.97,58.06 76.3,52.73 ; R22.1 78.37,54.79 76.3,52.73 ; 76.3,52.73 CN1.4
I2C_SDA: length 63.2
  Top Layer w0.22: v1(40.46,48.86) 40.46,48.1 v1(38.69,46.32) ; v1(43.77,50.9) 43.77,51.92 44.57,52.73 49.14,52.73 v1(49.65,53.23) ; v1(51.94,54.76) 52.44,55.27 68.95,55.27 v1(70.99,53.23)
  Top Layer w0.254: v1(74.16,50.82) v1(68.83,50.82)
  Bottom Layer w0.22: 39.54,43.88 39.45,43.78 39.19,43.78 38.94,44.04 38.94,44.16 37.92,45.18 37.92,45.82 38.43,46.32 v1(38.69,46.32) ; v1(43.77,50.9) 43.26,50.39 41.99,50.39 v1(40.46,48.86) ; v1(70.99,53.23) 73.78,53.23 74.54,52.47 CN1.3 ; v1(51.94,54.76) 51.17,54.76 v1(49.65,53.23)
  Bottom Layer w0.254: 74.8,51.2 75.3,50.69 79.1,50.69 R21.1 ; 74.8,51.2 74.8,51.71 CN1.3 ; 74.8,51.2 74.54,51.2 v1(74.16,50.82) ; v1(68.83,50.82) U7.5
LCD_BL: length 42.5
  Top Layer w0.22: v1(47.47,49.84) 42.64,49.84 41.76,50.72 40.24,50.72 37.31,53.65 30.2,53.65 v1(26.64,50.1)
  Bottom Layer w0.22: v1(47.47,49.84) 48.23,49.08 49.36,49.08 ; 21.78,49.12 23.01,50.35 26.39,50.35 v1(26.64,50.1)
  Bottom Layer w0.254: Q1.1 21.78,45.56 21.02,44.8 21.02,42.01 21.78,41.24 21.78,40.74 ; 21.78,40.74 21.78,40.62 R25.1 ; 21.78,40.74 23.06,40.74 R25.2
LCD_CS: length 27.1
  Top Layer w0.22: v1(53.66,49.34) 55.69,49.34 v1(56.45,50.11) ; v1(60.52,37.15) v1(56.96,40.71)
  Bottom Layer w0.22: FPC1.12 61.02,36.64 v1(60.52,37.15) ; v1(56.45,50.11) 55.48,51.08 49.36,51.08 ; v1(53.66,49.34) 56.45,46.55 56.45,41.22 v1(56.96,40.71)
LCD_DC: length 24.3
  Bottom Layer w0.22: 49.36,49.88 53.42,49.88 53.54,50.01 53.8,50.01 54.42,49.38 54.42,49.13 57.72,45.83 57.72,37.19 60.77,34.14 FPC1.7
LCD_MOSI: length 25.9
  Top Layer w0.22: v1(63.56,37.18) 63.56,38.2 57.98,43.79 v1(57.98,46.58)
  Bottom Layer w0.22: FPC1.8 62.55,34.64 62.8,34.9 62.8,36.42 v1(63.56,37.18) ; U1.44 53.29,50.28 53.66,50.65 53.91,50.65 v1(57.98,46.58)
LCD_RST: length 25.9
  Bottom Layer w0.22: FPC1.6 60.52,33.64 55.94,38.22 55.94,45.33 54.93,46.34 53.15,46.34 51.88,45.07 51.37,45.07 50.86,45.58 50.86,48.48 49.87,49.48 U1.46
LCD_SCK: length 28.3
  Top Layer w0.22: v1(57.27,49.37) 57.27,50.13 56.72,50.68 v1(48.64,50.68) ; v1(59.81,42.76) 59.81,44.8 v1(58.8,45.81)
  Bottom Layer w0.22: v1(57.27,49.37) 59.81,46.83 59.81,46.32 59.3,45.81 v1(58.8,45.81) ; FPC1.9 60.52,35.14 59.81,35.85 v1(59.81,42.76) ; v1(48.64,50.68) U1.43
LPO_IN: length 27.3
  Top Layer w0.25: v1(48.51,60.98) 48.26,61.24 v1(41.15,61.24)
  Bottom Layer w0.25: U7.7 62.48,51.84 53.34,60.98 v1(48.51,60.98) ; v1(41.15,61.24) 40.96,61.04 40.13,61.04
QSPI_SCLK: length 24.4
  Top Layer w0.254: v1(35.69,38.51) 36.19,39.01 36.19,42.06 35.94,42.32 35.94,46.89 v1(35.56,47.27)
  Bottom Layer w0.254: U4.6 36.45,48.79 34.67,47.01 ; U3.6 35.69,37.04 v1(35.69,38.51) ; R7.1 29.46,50.72 32.26,50.72 33.27,49.7 33.27,47.78 34.04,47.01 34.67,47.01 ; 34.67,47.01 35.31,47.01 v1(35.56,47.27)
QSPI_SD0: length 20.1
  Top Layer w0.254: v1(36.58,46.02) 37.47,46.91 v1(37.47,47.92) ; v1(35.43,39.29) 35.43,42.08 v1(32.64,44.88) 33.02,44.88 v1(34.16,46.02)
  Bottom Layer w0.254: U4.5 37.47,49.05 v1(37.47,47.92) ; v1(35.43,39.29) 35.94,39.29 37.21,38.02 U3.5 ; v1(32.64,44.88) 31.37,44.88 R8.1 ; v1(34.16,46.02) v1(36.58,46.02)
QSPI_SD1: length 28.8
  only ground w0.254: v1(35.18,44.87) 35.18,46.83 34.98,47.03 34.98,47.51 35.18,47.71 35.18,51.07 33.83,52.41 33.83,55.92 34.23,56.32 35.18,56.32 v1(35.43,56.06)
  Bottom Layer w0.254: v1(35.43,56.06) 35.43,54.69 U4.2 35.18,53.39 34.43,52.63 34.43,52.12 34.93,51.62 36.71,51.62 40.78,55.68 42.3,55.68 R9.1
QSPI_SD2: length 19.2
  Top Layer w0.254: v1(32.13,49.86) 34.67,52.4 v1(35.17,52.4) ; v1(32.63,47.32) 31.87,46.56 31.87,44.78 v1(34.41,42.24)
  Bottom Layer w0.254: v1(35.17,52.4) 36.45,53.68 U4.3 ; U3.3 35.94,43.33 34.85,42.24 v1(34.41,42.24) ; R10.1 31.77,49.96 31.87,49.86 v1(32.13,49.86) 32.13,47.83 v1(32.63,47.32)
QSPI_SD3: length 20.7
  Top Layer w0.254: v1(34.16,47.8) 33.9,48.06 32.13,48.06 v1(29.84,45.77) 29.84,44.25 v1(34.67,39.42)
  Bottom Layer w0.254: R11.1 28.82,45.77 v1(29.84,45.77) ; U4.7 35.18,48.82 v1(34.16,47.8) ; v1(34.67,39.42) 34.67,36.79
QSPI_SS: length 71.3
  Top Layer w0.22: v1(42.92,40.1) 42.92,41.25 v1(42.52,41.64) ; v1(62.98,37.9) 62.98,38.2 54.86,46.33 53.59,46.33 51.81,44.55 v1(51.81,44.3) ; v1(29.34,42.96) 38.23,34.07 v1(39.11,34.07) ; v1(43.17,33.82) v1(43.17,32.55)
  Bottom Layer w0.22: v1(51.81,44.3) 48.76,41.25 48.76,39.47 48,38.71 45.2,38.71 ; v1(43.17,33.82) 44.44,35.09 44.44,35.91 44.19,36.17 44.19,37.69 45.2,38.71 ; 45.2,38.71 44.31,38.71 v1(42.92,40.1) ; v1(42.52,41.64) 42.52,42.18 42.68,42.33 42.68,42.74 U1.75 ; U3.1 30.22,43.84 v1(29.34,42.96) ; R23.1 70.86,38.15 69.08,38.15 68.06,39.17 65.52,39.17 65.02,38.66 63.75,38.66 v1(62.98,37.9) ; v1(43.17,32.55) 40.63,32.55 v1(39.11,34.07)
RUN: length 145.2
  Top Layer w0.22: v1(73.93,25.07) 74.44,25.58 74.44,26.09 73.43,27.11 v1(72.92,27.11) ; v1(70.89,28.63) 70.89,29.14 69.36,30.66 69.36,41.84 66.82,44.38 62.5,44.38 v1(60.47,46.41) ; v1(47.44,51.57) 47.69,51.82 56.58,51.82 56.84,51.57 56.84,51.32 58.69,49.46 v1(59.96,49.46) ; v1(9.67,50.02) 8.91,49.26 8.91,41.38 21.92,28.38 34.56,28.38 35.33,29.14 v1(35.33,31.68) ; v1(71.39,22.28) 54.38,22.28 v1(44.98,31.68)
  Bottom Layer w0.22: v1(60.47,46.41) 60.47,48.95 v1(59.96,49.46) ; v1(44.98,31.68) v1(35.33,31.68) ; v1(73.93,25.07) 73.93,23.55 72.66,22.28 v1(71.39,22.28) ; v1(72.92,27.11) C23.1 72.16,27.36 v1(70.89,28.63) ; v1(47.44,51.57) 46.68,51.57 46.25,52 U1.35 ; SW6.1 8.91,50.02 v1(9.67,50.02)
  Bottom Layer w0.254: SW6.1 SW6.2
USB_DM: length 76
  Top Layer w0.22: 44.19,39.95 44.19,39.18 v1(45.46,37.91) ; 44.19,39.95 v1(45.97,41.72) ; 44.19,39.95 42.16,37.91 v1(42.16,37.53) ; v1(55.87,46.3) v1(57.14,45.03) ; v1(65.02,35.63) 64.26,35.63 v1(57.14,42.74) ; v1(51.05,42.23) 51.05,45.28 v1(51.56,45.79)
  Bottom Layer w0.22: v1(45.97,41.72) 46.25,42.01 U1.66 ; R15.1 28.07,40.83 32.13,40.83 32.76,40.2 36.57,40.2 38.35,38.42 41.27,38.42 v1(42.16,37.53) ; R17.1 65.02,34.83 v1(65.02,35.63) ; v1(45.46,37.91) 47.75,37.91 51.05,41.22 v1(51.05,42.23) ; v1(51.56,45.79) 52.83,47.06 55.11,47.06 v1(55.87,46.3) ; v1(57.14,45.03) v1(57.14,42.74)
  Bottom Layer w0.254: USB1.A7 75.98,32.05 75.38,32.05 74.9,32.53 74.9,33.06 ; 74.9,33.06 73.63,33.06 73.12,33.57 67.78,33.57 R17.2 R17.1 ; 74.9,33.06 USB1.B7 ; R15.2 R15.1
USB_DP: length 59.7
  Top Layer w0.22: v1(48.87,32.13) 49.96,31.04 49.96,29.9 50.71,29.15 50.71,29.01 53.67,26.05 57.74,26.05 v1(63.57,31.87) ; v1(46.08,36.45) 46.59,36.95 46.59,42.8 v1(45.83,43.56)
  Top Layer w0.254: v1(74.34,32.31) 70.97,35.68 v1(70.79,35.68)
  Bottom Layer w0.22: 64.84,32.64 64.33,32.64 v1(63.57,31.87) ; v1(48.87,32.13) 48.87,33.65 v1(46.08,36.45) ; U1.67 45.83,42.8 v1(45.83,43.56)
  Bottom Layer w0.254: v1(70.79,35.68) 69.52,35.68 67.74,37.46 R18.2 65.96,37.46 65.34,36.84 ; R16.2 R16.1 65.09,32.38 64.33,33.14 64.33,35.83 65.34,36.84 ; USB1.A6 76.63,32.56 76.88,32.31 76.88,31.8 76.63,31.55 76.12,31.55 ; 65.34,36.84 65.34,37.08 R18.1 ; 76.12,31.55 USB1.B6 ; 76.12,31.55 74.85,31.55 74.34,32.05 v1(74.34,32.31)
VSYS: length 66.3
  Top Layer w0.254: v1(19.05,47.9) 25.4,54.25 37.34,54.25 37.85,53.74 42.67,53.74 42.93,53.99 44.96,53.99 45.21,53.74 48.01,53.74 48.26,53.99 60.71,53.99 v1(65.28,49.42)
  Bottom Layer w0.254: 67.82,47.14 67.82,48.79 69.6,50.57 C4.1 ; 67.82,47.14 U10.4 ; 67.82,47.14 67.56,47.14 ; U10.1 66.01,44.95 67.56,46.51 67.56,47.14 ; 67.56,47.14 67.56,47.39 66.55,48.41 66.29,48.41 v1(65.28,49.42) ; U15.1 17.72,47.14 19.3,47.14 ; v1(19.05,47.9) 19.3,47.64 19.3,47.14 ; 19.3,47.14 U14.1
WL_CLK: length 12.9
  Top Layer w0.22: v1(46.29,54.36) 47.81,54.36 48.57,55.13 48.57,58.11 46.8,59.89 45.41,59.89 v1(45.16,60.15)
  Bottom Layer w0.22: U1.37 47.05,53.6 v1(46.29,54.36) ; v1(45.16,60.15) 45.61,59.69 U12.20
WL_CS: length 10.3
  Top Layer w0.22: v1(43.67,54.87) 45.44,54.87 46.21,55.63 46.21,56.4 45.7,56.9 45.42,56.9 v1(43.9,58.43)
  Bottom Layer w0.22: v1(43.67,54.87) 42.65,53.86 U1.26 ; U12.25 43.9,59.19 v1(43.9,58.43)
WL_D: length 34.7
  Top Layer w0.22: v1(49.16,57.59) 49.16,61.14 47.13,63.17 41.54,63.17 38.24,59.87 38.24,57.33 41.03,54.54 v1(42.05,54.54)
  Bottom Layer w0.22: 49.16,56.32 v1(49.16,57.59) ; v1(42.05,54.54) 42.25,54.33 U1.25
  Bottom Layer w0.25: R20.2 46.09,58.6 45.58,58.6 45.3,58.88 U12.22 U12.23
  Bottom Layer w0.254: R20.2 49.16,56.32 49.28,56.19 R19.2
WL_ON: length 25.8
  Top Layer w0.25: v1(45.16,62.39) 44.91,62.65 41.6,62.65 38.66,59.7 38.66,57.67 41.2,55.13 v1(42.72,55.13)
  Bottom Layer w0.22: v1(42.72,55.13) 43.11,55.13 43.87,55.89 43.87,56.9 42.6,58.17 U12.28 ; U1.23 41.45,54.87 41.7,55.13 42.47,55.13
  Bottom Layer w0.25: v1(45.16,62.39) U12.14 ; 42.47,55.13 v1(42.72,55.13)
  Bottom Layer w0.254: U12.14 v1(46.99,62.39)
XIN: length 49.2
  Top Layer w0.22: v1(48.68,53.36) 48.43,53.1 44.51,53.1 v1(44.26,53.36)
  Top Layer w0.254: v1(56.83,54.63) 62.67,54.63 70.12,47.17 v1(70.12,31.17)
  Bottom Layer w0.22: v1(48.68,53.36) 49.45,52.59 53.76,52.59 55.8,54.63 ; v1(44.26,53.36) 44.26,52.59
  Bottom Layer w0.254: C16.1 69.36,30.41 v1(70.12,31.17) ; v1(56.83,54.63) 55.8,54.63
XOUT: length 17.5
  Top Layer w0.22: v1(58.13,51.98) 57.87,52.23 45.01,52.23 v1(44.5,51.72)
  Bottom Layer w0.22: v1(44.5,51.72) 44.65,51.88 U1.31 ; 58.13,52.23 v1(58.13,51.98)
  Bottom Layer w0.254: U8.3 58.13,52.8 58.13,52.23 58.63,51.72 58.63,51.21 C17.2
$1N4978: length 59.6
  Top Layer w0.254: v1(49.65,54.79) 50.66,55.81 70.22,55.81 76,50.03 v1(76,49.27) ; v1(45.58,56.06) 45.33,56.32 v1(42.03,56.32)
  Bottom Layer w0.254: USB1.A5 76.8,33.56 77.77,34.54 77.77,35.56 80.82,38.6 80.82,44.45 v1(76,49.27) ; R1.2 41.52,56.82 v1(42.03,56.32) ; v1(45.58,56.06) 46.85,54.79 v1(49.65,54.79)
$1N4982: length 60.6
  Top Layer w0.254: v1(69.97,29.01) 69.46,28.5 69.44,28.5 68.2,29.73 67.72,29.73 66.49,28.5 62.09,28.5 59.3,25.71 52.95,25.71 50.37,28.29 50.37,29.01 49.39,29.98 v1(49.39,30.53)
  Bottom Layer w0.254: v1(69.97,29.01) 70.22,29.26 72.51,29.26 73.81,30.56 USB1.B5 ; R2.2 28.31,30.53 v1(49.39,30.53)
$1N5126: length 61.5
  Top Layer w0.254: v1(24.38,47.91) 24.38,44.61 39.12,29.88 v1(39.12,29.12)
  Bottom Layer w0.254: v1(24.38,47.91) 24.89,48.42 C6.1 ; U5.4 43.22,22.98 38.35,27.85 38.35,28.35 v1(39.12,29.12)
$1N5202: length 52.4
  Top Layer w0.254: v1(46.35,31.3) v1(49.14,28.5)
  Bottom Layer w0.254: v1(49.14,28.5) 52.76,24.88 U5.5 ; R3.1 30.6,31.04 46.09,31.04 v1(46.35,31.3)
$1N5235: length 50.7
  Top Layer w0.254: v1(32.25,35.74) 38.34,29.65 38.34,28.88 v1(39.1,28.12)
  Bottom Layer w0.254: v1(39.1,28.12) 43.11,24.12 70.54,24.12 71.3,24.88 U5.1 ; LED4.2 29.45,38.54 v1(32.25,35.74)
$1N5247: length 6.4
  Bottom Layer w0.254: LED4.1 27.3,39.81 R4.2
$1N8083: length 65.2
  Top Layer w0.254: v1(68.1,42.13) 68.1,34 v1(65.14,31.04)
  Bottom Layer w0.254: R5.1 20.57,32.06 22.47,32.06 R6.2 26.28,29.77 50.41,29.77 53.2,26.98 61.08,26.98 v1(65.14,31.04) ; v1(68.1,42.13) U10.5
$1N8205: length 5.6
  Top Layer w0.254: v1(69.24,46.85) 66.96,46.85 v1(66.7,47.11)
  Bottom Layer w0.254: U10.3 65.76,47.11 v1(66.7,47.11) ; L2.2 69.44,47.04 v1(69.24,46.85)
$1N8633: length 2.5
  Bottom Layer w0.22: U1.63 47.45,40.85 L1.2
$1N9372: length 20.9
  Top Layer w0.22: v1(43.03,44.24) 41.91,43.12 38.1,43.12 37.34,43.88 v1(37.34,45.66)
  Bottom Layer w0.22: R7.2 30.99,45.66 33.27,45.66 33.49,45.44 37.12,45.44 v1(37.34,45.66) ; U1.71 44.25,43.82 43.69,44.39 43.18,44.39 v1(43.03,44.24)
$1N9469: length 18
  Top Layer w0.22: v1(44.06,41.64) 44.06,40.44 42.96,39.34 v1(42.58,39.34) ; v1(36.79,41.5) 36.79,40.99 v1(37.81,39.98)
  Bottom Layer w0.22: v1(36.79,41.5) 32.73,41.5 R8.2 ; v1(37.81,39.98) 38.44,39.34 40.07,39.34 40.41,39.68 41.55,39.68 41.89,39.34 v1(42.58,39.34) ; U1.72 43.88,42.74 43.88,42.33 44.06,42.15 v1(44.06,41.64)
$1N9502: length 16.2
  only ground w0.254: v1(43.31,41.96) 44.47,43.12 44.47,50.87 45.08,51.48 45.08,51.96 44.84,52.21 44.84,53.6 44.7,53.73 v1(44.7,55.68)
  Bottom Layer w0.254: 43.18,42.09 43.18,42.2 43.06,42.32 43.06,42.76 U1.74 ; v1(44.7,55.68) 44.7,56.31 R9.2
$1N9530: length 28.3
  Top Layer w0.22: v1(30.6,48.2) 29.71,48.2 28.44,46.93 28.44,45.83 28.94,45.33 28.94,44.16 35.06,38.04 35.35,38.04 35.45,37.94 36.57,37.94 38.38,39.74 38.38,40.21 38.35,40.24 38.35,41.85 39.29,42.79 42.39,42.79 43.28,43.68 v1(43.56,43.68)
  Bottom Layer w0.22: v1(43.56,43.68) 43.45,43.58 U1.73 ; R10.2 30.86,48.46 v1(30.6,48.2)
$1N9625: length 20.3
  Bottom Layer w0.22: U1.70 44.65,40.74 42,40.74 41.49,40.23 40.98,40.23 40.48,40.74 32.86,40.74 32.23,41.37 29.69,41.37 R11.2
$1N13630: length 9.9
  Top Layer w0.25: v1(47.97,55.43) 44.92,58.47 v1(44.66,58.47)
  Bottom Layer w0.25: v1(47.97,55.43) 51.3,55.43 R19.1 ; U12.24 44.4,58.74 v1(44.66,58.47)
$1N13750: length 5.6
  Bottom Layer w0.25: U12.26 43.5,58.86 43.25,58.6 43.25,58.09 43.5,57.84 45.35,57.84 R20.1
$1N13874: length 9.9
  Bottom Layer w0.254: U7.1 61.21,55.93 64.01,53.14 X1.2 67.83,52.87 C18.1
$1N13880: length 8.5
  Bottom Layer w0.254: C19.1 67.67,55.79 X1.1 65.79,57.46 63.5,57.46 62.48,56.45 U7.2
$1N14224: length 3
  Bottom Layer w0.254: C21.2 71.61,32.1 72.41,31.3 72.41,30.03 C20.1
$1N14355: length 27.9
  Bottom Layer w0.25: 46.07,63.36 45.56,63.86 40.99,63.86 40.8,63.68 U12.1 ; 46.07,63.36 47.08,63.36 47.76,62.68 47.76,61.41 46.49,60.14 46.49,59.94 46.74,59.69 46.74,59.43 46.49,59.18 ; 46.07,63.36 U12.12
  Bottom Layer w0.254: 47.14,60.14 47.88,60.89 47.88,63.3 46.03,63.3 U12.12 45.71,63.63 45.71,63.66 45.54,63.82 41.01,63.82 40.85,63.66 40.85,63.34 U12.1 ; 47.14,60.14 47.75,60.14 47.75,59.29 47.64,59.18 U12.21 ; 47.14,60.14 U12.19
$1N14602: length 5.5
  Top Layer w0.25: v1(39.37,59.19) 39.87,59.19 v1(40.64,58.42)
  Bottom Layer w0.25: v1(39.37,59.19) 39.37,59.44 39.62,59.69 40.13,59.69 ; v1(40.64,58.42) 40.94,58.42 41.25,58.74 U12.31
  Bottom Layer w0.254: 40.13,59.69 40.48,59.69 40.56,59.77 41.04,59.77 41.21,59.61 41.21,59.29 U12.31
$1N15410: length 61.4
  Top Layer w0.254: v1(32.58,34.43) v1(31.31,35.7)
  Bottom Layer w0.254: v1(31.31,35.7) 28.26,35.7 24.19,39.77 21.15,39.77 20.13,40.78 20.13,49.12 Q1.2 ; FPC1.3 62.55,32.15 62.8,31.89 62.8,29.35 61.02,27.57 53.4,27.57 49.59,31.38 47.31,31.38 45.53,33.16 41.21,33.16 39.69,34.69 32.83,34.69 v1(32.58,34.43)
$1N16712: length 69.6
  Top Layer w0.254: v1(55.38,50.09) 48.78,50.09 47.76,49.08 47.12,49.08 46.86,49.33 41.16,49.33 40.39,50.09 37.35,50.09 36.08,51.36 34.55,51.36 32.27,49.08 32.01,49.08 31.5,49.58 26.93,49.58 v1(26.68,49.33) ; v1(65.03,40.19) 65.03,40.69 v1(59.19,46.54)
  Bottom Layer w0.254: v1(26.68,49.33) 26.93,49.33 27.44,49.84 27.44,50.35 26.93,50.85 21.85,50.85 21.34,50.35 17.72,50.35 SW7.1 SW7.2 ; R23.2 68.84,40.19 v1(65.03,40.19) ; v1(55.38,50.09) 58.94,46.54 v1(59.19,46.54)
$1N16990: length 4.1
  Bottom Layer w0.254: R26.2 75.89,38.32 77.84,38.32 LED1.1
$1N17040: length 4.2
  Bottom Layer w0.254: LED3.1 9.63,34.86 R28.2
$1N17066: length 4.1
  Bottom Layer w0.254: R27.2 76.27,22.62 78.22,22.62 LED2.1
$1N21767: length 7.1
  Bottom Layer w0.3: JP1.2 33.09,62.84 40.13,62.84

## Copper pours and planes (outline as drawn; the poured copper is in the pictures)
GND on Power routing: 0.38,57.08 83.95,57.08 83.95,0.05 0.38,0.05

## Text on the board
Bottom Silkscreen Layer: Reset | BOOT | battery
Top Silkscreen Layer: Button A | SW2 | Button C | display | DOWN | UP | HACKABLE bdge
